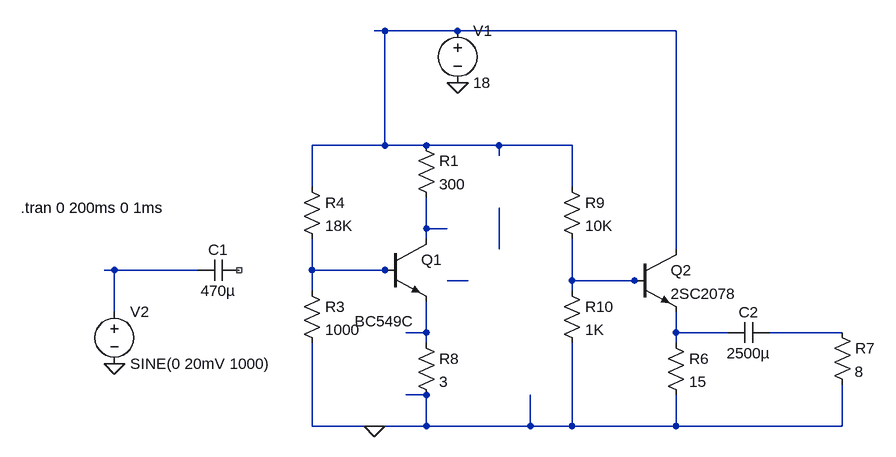
[diagram p0: schematic Common Emitter with Common Collector - without bypass cap.asc]
Common Emitter with Common Collector - without bypass cap.asc, the LTspice schematic file:
Version 4
SHEET 1 920 680
WIRE 160 -256 144 -256
WIRE 272 -256 160 -256
WIRE 608 -256 272 -256
WIRE 160 -80 160 -256
WIRE 160 -80 48 -80
WIRE 224 -80 160 -80
WIRE 336 -80 224 -80
WIRE 448 -80 336 -80
WIRE 336 -64 336 -80
WIRE 48 -16 48 -80
WIRE 448 -16 448 -80
WIRE 224 48 224 0
WIRE 256 48 224 48
WIRE 224 64 224 48
WIRE 336 80 336 16
WIRE 608 80 608 -256
WIRE -256 112 -272 112
WIRE -128 112 -256 112
WIRE 48 112 48 64
WIRE 160 112 48 112
WIRE 176 112 160 112
WIRE 288 128 256 128
WIRE 448 128 448 64
WIRE 544 128 448 128
WIRE 560 128 544 128
WIRE 48 144 48 112
WIRE 448 144 448 128
WIRE -256 176 -256 112
WIRE 224 208 224 160
WIRE 224 208 192 208
WIRE 608 208 608 176
WIRE 688 208 608 208
WIRE 864 208 752 208
WIRE 224 224 224 208
WIRE 608 224 608 208
WIRE 224 304 192 304
WIRE 48 352 48 224
WIRE 144 352 48 352
WIRE 224 352 224 304
WIRE 224 352 144 352
WIRE 384 352 384 304
WIRE 384 352 224 352
WIRE 448 352 448 224
WIRE 448 352 384 352
WIRE 608 352 608 304
WIRE 608 352 448 352
WIRE 864 352 864 288
WIRE 864 352 608 352
FLAG 272 -176 0
FLAG 144 352 0
FLAG -256 256 0
SYMBOL npn 160 64 R0
WINDOW 3 -46 127 Left 2
SYMATTR Value BC549C
SYMATTR InstName Q1
SYMBOL res 208 -96 R0
SYMATTR InstName R1
SYMATTR Value 300
SYMBOL voltage 272 -272 R0
WINDOW 123 0 0 Left 2
WINDOW 39 0 0 Left 2
SYMATTR InstName V1
SYMATTR Value 18
SYMBOL res 32 -32 R0
SYMATTR InstName R4
SYMATTR Value 18K
SYMBOL res 32 128 R0
SYMATTR InstName R3
SYMATTR Value 1000
SYMBOL cap -64 96 R90
WINDOW 0 0 32 VBottom 2
WINDOW 3 32 32 VTop 2
SYMATTR InstName C1
SYMATTR Value 470µ
SYMBOL voltage -256 160 R0
WINDOW 123 0 0 Left 2
WINDOW 39 0 0 Left 2
SYMATTR InstName V2
SYMATTR Value SINE(0 20mV 1000)
SYMBOL npn 544 80 R0
SYMATTR InstName Q2
SYMATTR Value 2SC2078
SYMBOL res 592 208 R0
SYMATTR InstName R6
SYMATTR Value 15
SYMBOL res 848 192 R0
WINDOW 3 35 76 Left 2
SYMATTR Value 8
SYMATTR InstName R7
SYMBOL cap 752 192 R90
WINDOW 0 0 32 VBottom 2
WINDOW 3 32 32 VTop 2
SYMATTR InstName C2
SYMATTR Value 2500µ
SYMBOL res 432 -32 R0
SYMATTR InstName R9
SYMATTR Value 10K
SYMBOL res 432 128 R0
SYMATTR InstName R10
SYMATTR Value 1K
SYMBOL res 208 208 R0
SYMATTR InstName R8
SYMATTR Value 3
TEXT -400 16 Left 2 !.tran 0 200ms 0 1ms

The netlist it stands for:
* Common Emitter with Common Collector - without bypass cap.asc
Q1 N002 N005 N008 0 BC549C
R1 N001 N002 300
V1 N001 0 18
R4 N001 N005 18K
R3 N005 0 1000
C1 NC_01 N004 470µ
V2 N004 0 SINE(0 20mV 1000)
Q2 N001 N007 N009 0 2SC2078
R6 N009 0 15
R7 N010 0 8
C2 N010 N009 2500µ
R9 N001 N007 10K
R10 N007 0 1K
R8 N008 0 3
.model NPN NPN
.model PNP PNP
.lib standard.bjt
.tran 0 200ms 0 1ms
.backanno
.end